# EAGLE design jammasave (EAGLE 7.6.0)
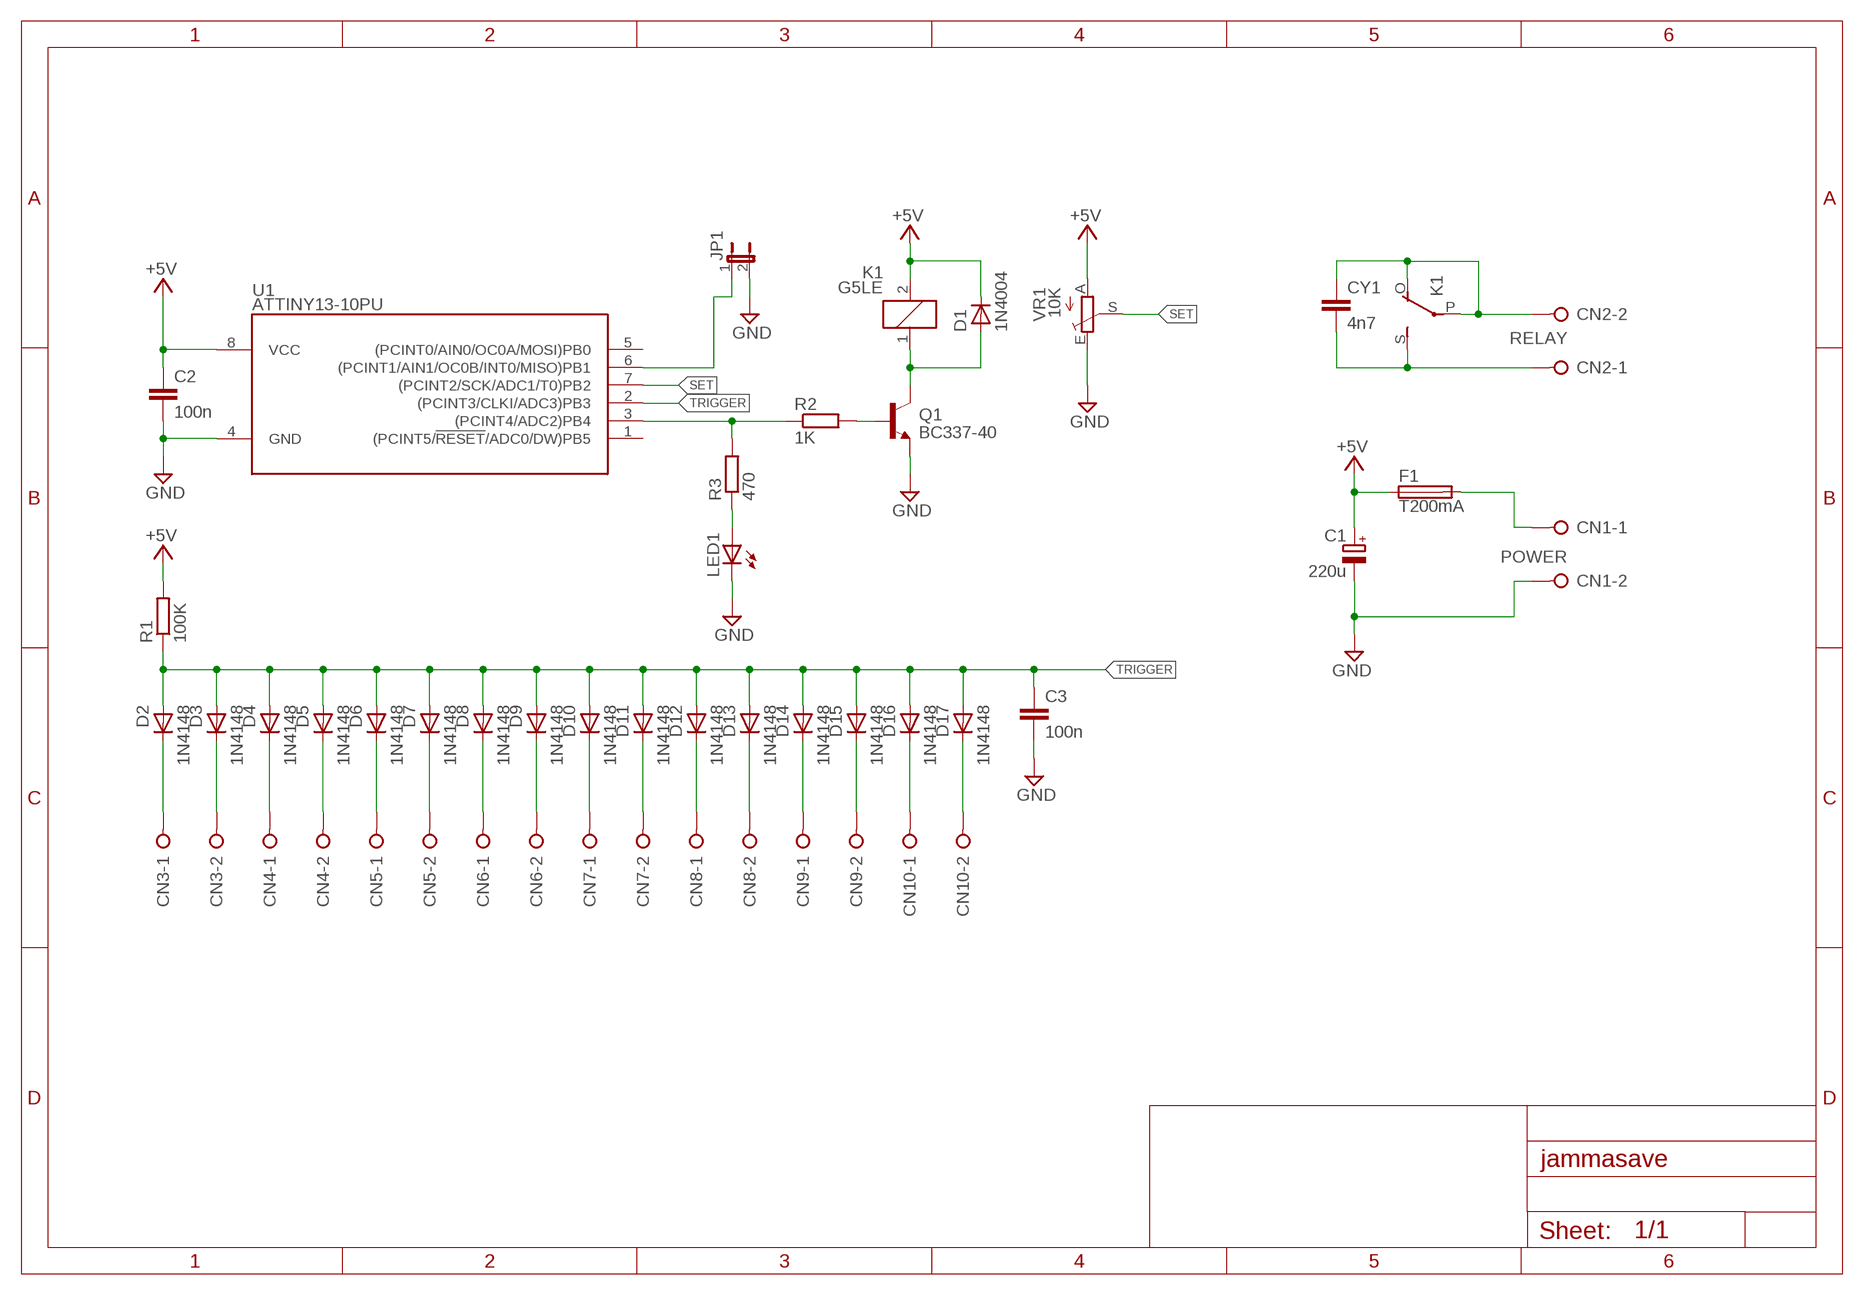
[diagram p0: schematic, sheet 1]

## Parts
C1  220u  CPOL-EUE3.5-8  [E3,5-8]
C2  100n  C-EU050-035X075  [C050-035X075]
C3  100n  C-EU050-035X075  [C050-035X075]
CN1  POWER  W237-02P  [W237-132]
CN2  RELAY  W237-2N  [W237-2N]
CN3  W237-02P  [W237-132]
CN4  W237-02P  [W237-132]
CN5  W237-02P  [W237-132]
CN6  W237-02P  [W237-132]
CN7  W237-02P  [W237-132]
CN8  W237-02P  [W237-132]
CN9  W237-02P  [W237-132]
CN10  W237-02P  [W237-132]
CY1  4n7  CYYC10B5  [YC10B5]
D1  1N4004  -DIODE_DO41-10  [DO41-10]
D2  1N4148  -DIODE_DO35-7  [DO35-7]
D3  1N4148  -DIODE_DO35-7  [DO35-7]
D4  1N4148  -DIODE_DO35-7  [DO35-7]
D5  1N4148  -DIODE_DO35-7  [DO35-7]
D6  1N4148  -DIODE_DO35-7  [DO35-7]
D7  1N4148  -DIODE_DO35-7  [DO35-7]
D8  1N4148  -DIODE_DO35-7  [DO35-7]
D9  1N4148  -DIODE_DO35-7  [DO35-7]
D10  1N4148  -DIODE_DO35-7  [DO35-7]
D11  1N4148  -DIODE_DO35-7  [DO35-7]
D12  1N4148  -DIODE_DO35-7  [DO35-7]
D13  1N4148  -DIODE_DO35-7  [DO35-7]
D14  1N4148  -DIODE_DO35-7  [DO35-7]
D15  1N4148  -DIODE_DO35-7  [DO35-7]
D16  1N4148  -DIODE_DO35-7  [DO35-7]
D17  1N4148  -DIODE_DO35-7  [DO35-7]
F1  T200mA  FUSETE5  [TE5]
JP1  JP1E  [JP1]
K1  G5LE  [G5LE]
LED1  LED3MM  [LED3MM]
Q1  BC337-40  -NPN_TO92_254-CBE  [TO92-254]
R1  100K  R-EU_0207/10  [0207/10]
R2  1K  R-EU_0207/10  [0207/10]
R3  470  R-EU_0207/10  [0207/10]
U1  ATTINY13-10PU  [DIL08]
VR1  10K  TRIM_EU-CA6V  [CA6V]

## Nets
+5V: C1.+ C2.1 D1.K(C) F1.1 K1.2 R1.2 U1.8(VCC) VR1.A
GND: C1.- C2.2 C3.2 CN1.2 JP1.2 LED1.K(C) Q1.3(E) U1.4(GND) VR1.E
N$1: Q1.2(B) R2.2
N$2: D1.A K1.1 Q1.1(C)
N$3: R2.1 R3.2 U1.3((PCINT4/ADC2)PB4)
N$4: CN1.1 F1.2
N$5: LED1.A R3.1
N$6: JP1.1 U1.6((PCINT1/AIN1/OC0B/INT0/MISO)PB1)
N$8: CN2.2 CY1.1 K1.O(2:O) K1.P(2:P)
N$11: CN2.1 CY1.2 K1.S(2:S)
N$13: CN3.1 D2.K(C)
N$14: CN3.2 D3.K(C)
N$15: CN4.1 D4.K(C)
N$16: CN4.2 D5.K(C)
N$17: CN5.1 D6.K(C)
N$18: CN5.2 D7.K(C)
N$19: CN6.1 D8.K(C)
N$20: CN6.2 D9.K(C)
N$21: CN7.1 D10.K(C)
N$22: CN7.2 D11.K(C)
N$23: CN8.1 D12.K(C)
N$24: CN8.2 D13.K(C)
N$25: CN9.1 D14.K(C)
N$26: CN9.2 D15.K(C)
N$27: CN10.1 D16.K(C)
N$28: CN10.2 D17.K(C)
SET: U1.7((PCINT2/SCK/ADC1/T0)PB2) VR1.S
TRIGGER: C3.1 D2.A D3.A D4.A D5.A D6.A D7.A D8.A D9.A D10.A D11.A D12.A D13.A D14.A D15.A D16.A D17.A R1.1 U1.2((PCINT3/CLKI/ADC3)PB3)
Unconnected: U1.1((PCINT5/!RESET!/ADC0/DW)PB5) U1.5((PCINT0/AIN0/OC0A/MOSI)PB0)

## Library data of the parts
C1 = rcl:CPOL-EU: POLARIZED CAPACITOR, European symbol
C2 C3 = rcl:C-EU: CAPACITOR, European symbol
CN1 CN3-CN10 = con-wago-508:W237-02P: WAGO SREW CLAMP; OC_FARNELL: unknown; OC_NEWARK: unknown
CN2 = con-wago-508:W237-2N: WAGO SREW CLAMP; OC_FARNELL: unknown; OC_NEWARK: unknown
CY1 = rcl:CY: Y CAPACITOR for power line
D1-D17 = jc-discretesemi:*-DIODE_?
F1 = fuse:FUSE: Fuse; OC_FARNELL: unknown; OC_NEWARK: unknown
JP1 = jumper:JP1E: JUMPER
K1 = relay:G5LE: RELAY 1 x switch, 10 A/120 V AC, 8 A/30 V DC, Omron; OC_FARNELL: unknown; OC_NEWARK: unknown
LED1 = led:LED: LED OSRAM: - CHIPLED LG R971, LG N971, LY N971, LG Q971, LY Q971, LO R971, LY R971 LH N974, LH R974 LS Q976, LO Q976, LY Q976 LO Q996 - Hyper CHIPLED LW Q18S LB Q993, LB Q99A, LB R99A - SideLED LS A670, LO A670, LY A670, LG A670, LP A670 LB A673, LV A673, LT A673, LW A673 LH A674 LY A675 LS A676, LA A676, LO A676, LY A676, LW A676 LS A679, LY A679, LG A679 - Hyper Micro SIDELED® LS Y876, LA Y876, LO Y876, LY Y876 LT Y87S - SmartLED LW L88C, LW L88S LB L89C, LB L89S, LG L890 LS L89K, LO L89K, LY L89K LS L896, LA L896, LO L896, LY L896 - TOPLED LS T670, LO T670, LY T670, LG T670, LP T670 LSG T670, LSP T670, LSY T670, LOP T670, LYG T670 LG T671, LOG T671, LSG T671 LB T673, LV T673, LT T673, LW T673 LH T674 LS T676, LA T676, LO T676, LY T676, LB T676, LH T676, LSB T676, LW T676 LB T67C, LV T67C, LT T67C, LS T67K, LO T67K, LY T67K, LW E67C LS E67B, LA E67B, LO E67B, LY E67B, LB E67C, LV E67C, LT E67C LW T67C LS T679, LY T679, LG T679 LS T770, LO T770, LY T770, LG T770, LP T770 LB T773, LV T773, LT T773, LW T773 LH T774 LS E675, LA E675, LY E675, LS T675 LS T776, LA T776, LO T776, LY T776, LB T776 LHGB T686 LT T68C, LB T68C - Hyper Mini TOPLED® LB M676 - Mini TOPLED Santana® LG M470 LS M47K, LO M47K, LY M47K Source: http://www.osram.convergy.de LUXEON: - LUMILED® LXK2-PW12-R00, LXK2-PW12-S00, LXK2-PW14-U00, LXK2-PW14-V00 LXK2-PM12-R00, LXK2-PM12-S00, LXK2-PM14-U00 LXK2-PE12-Q00, LXK2-PE12-R00, LXK2-PE12-S00, LXK2-PE14-T00, LXK2-PE14-U00 LXK2-PB12-K00, LXK2-PB12-L00, LXK2-PB12-M00, LXK2-PB14-N00, LXK2-PB14-P00, LXK2-PB14-Q00 LXK2-PR12-L00, LXK2-PR12-M00, LXK2-PR14-Q00, LXK2-PR14-R00 LXK2-PD12-Q00, LXK2-PD12-R00, LXK2-PD12-S00 LXK2-PH12-R00, LXK2-PH12-S00 LXK2-PL12-P00, LXK2-PL12-Q00, LXK2-PL12-R00 Source: www.luxeon.com KINGBRIGHT: KA-3528ASYC Source: www.kingbright.com
Q1 = jc-discretesemi:*-NPN_?
R1-R3 = rcl:R-EU_: RESISTOR, European symbol
U1 = jc-avr:ATTINY13-
VR1 = pot:TRIM_EU-: POTENTIOMETER

## Board
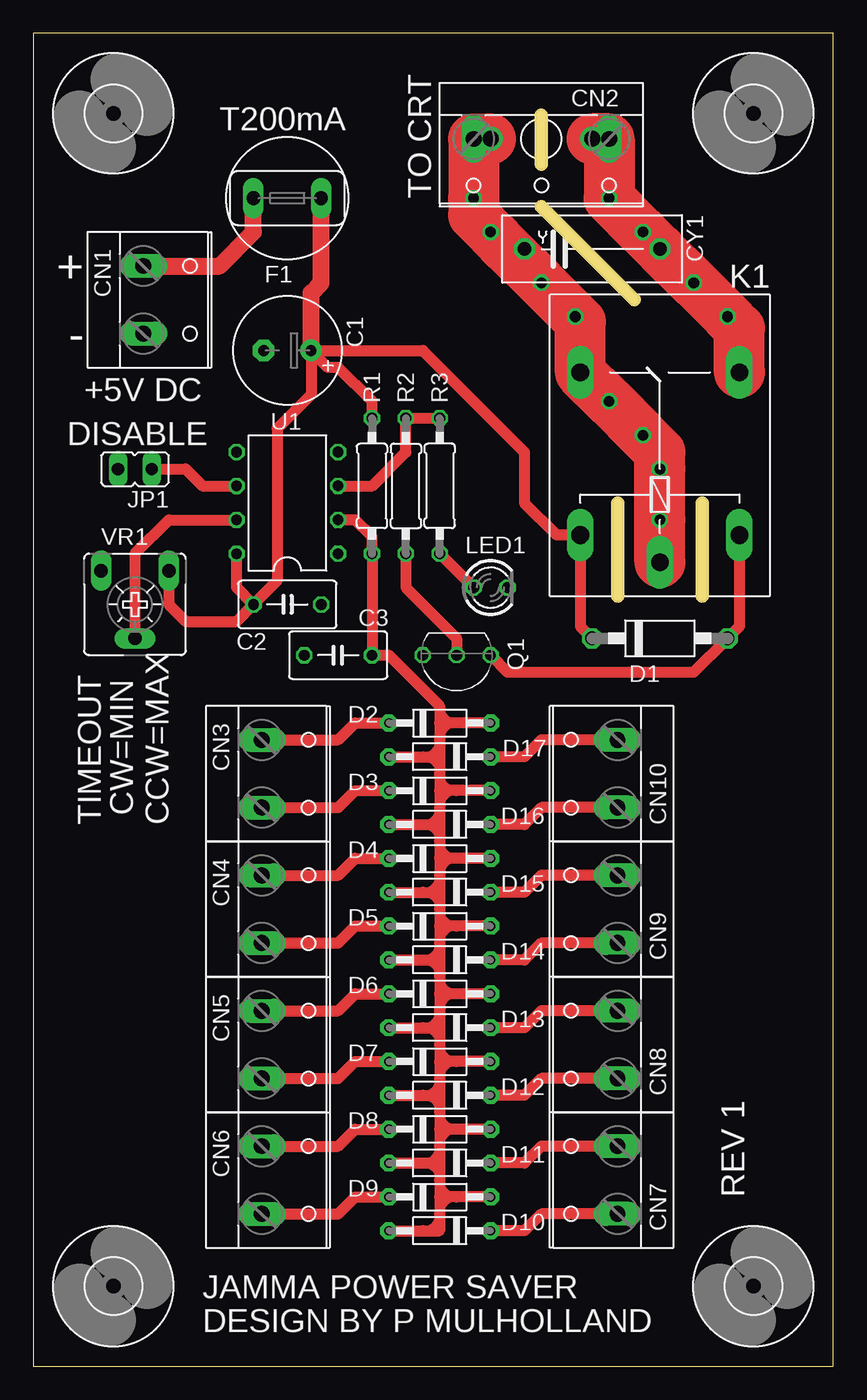
[diagram p1: board, top side]
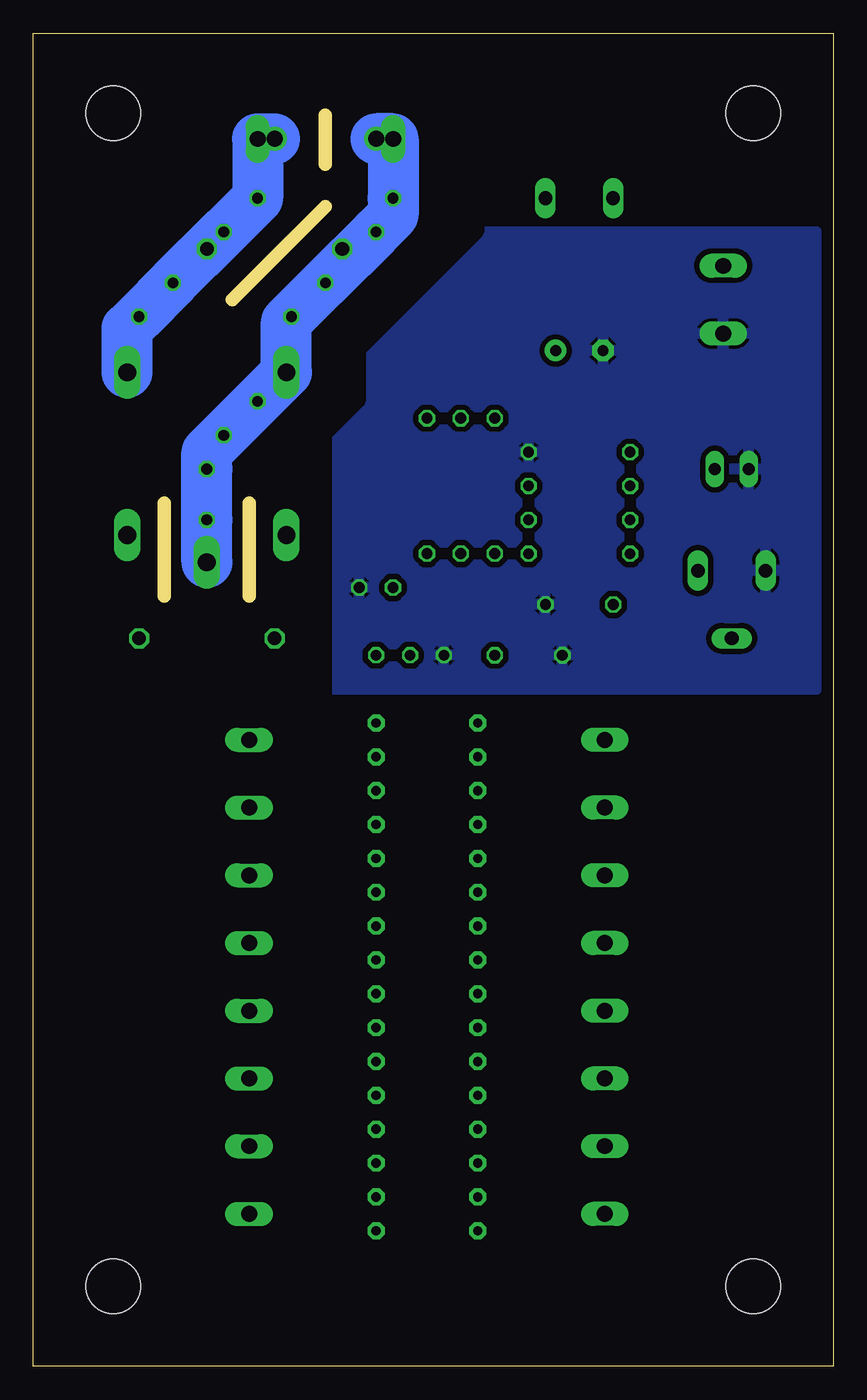
[diagram p2: board, bottom side, seen from below]

Size 60 x 100 mm. Coordinates in mm from the lower left corner, seen from the top.
Outline: 0,0 60,0 60,100 0,100 0,0
Copper layers (1*16): Top 0.035mm / dielectric 0.2mm / Bottom 0.035mm
Design rules "jlcpcb-2-layer": minimum track width 3.5mil, minimum drill 0.2mm, track to track 3.5mil, track to pad 5mil, pad to pad 5mil, via to via 5mil, smd to smd 0mil, copper to edge 0.1mm, drill to drill 5mil, minimum pad ring 4mil, minimum via ring 4mil, stop-mask expansion 3mil, vias tented up to drill 100mil, thermal gap 10mil
bRestrict: 5 lines
Milling: 4 lines

### Footprints (pad centres in the part's own frame; a part is rotated, then mirrored left to right if it is on the bottom)
E3,5-8 = drill 0.813 pad 1.6: + -1.778,0 | drill 0.813 pad 1.6 octagon: - 1.778,0
C050-035X075 = drill 0.813 octagon: 1 -2.54,0; 2 2.54,0
W237-132 = drill 1.194 long: 1 -2.54,-0.635; 2 2.54,-0.635
W237-2N = drill 1.194 long: 1 -5.08,-0.635; 2 5.08,-0.635
YC10B5 = drill 1.016 octagon: 1 -5.08,0; 2 5.08,0
DO41-10 = drill 1 octagon: A 5.08,0; K -5.08,0
DO35-7 = drill 0.7 pad 1.27 octagon: A 3.81,0; K -3.81,0
TE5 = drill 1.016 long: 1 -2.54,0; 2 2.54,0
JP1 = drill 0.914 long: 1 0,-1.27; 2 0,1.27
G5LE = drill 1.321 long: 1 -7.493,-5.969; 2 -7.493,5.969; O 4.699,5.969; P -9.525,0; S 4.699,-5.969
LED3MM = drill 0.813 octagon: A -1.27,0; K 1.27,0
TO92-254 = drill 0.8 octagon: 1 -2.54,0; 2 0,0; 3 2.54,0
0207/10 = drill 0.813 octagon: 1 -5.08,0; 2 5.08,0
DIL08 = drill 0.8 octagon: 1 -3.81,-3.81; 2 -1.27,-3.81; 3 1.27,-3.81; 4 3.81,-3.81; 5 3.81,3.81; 6 1.27,3.81; 7 -1.27,3.81; 8 -3.81,3.81
4,1 = hole 4.1: 0,0
CA6V = drill 1.016 long: A -2.54,-2.54; E 2.54,-2.54; S 0,2.54

### Placement (x,y rotation side)
C1  19.05,76.2 180 top
C2  19.05,57.15 0 top
C3  22.86,53.34 180 top
CN1  8.89,80.01 270 top
CN2  38.1,91.44 180 top
CN3  17.78,44.45 270 top
CN4  17.78,34.29 270 top
CN5  17.78,24.13 270 top
CN6  17.78,13.97 270 top
CN7  43.18,13.97 90 top
CN8  43.18,24.13 90 top
CN9  43.18,34.29 90 top
CN10  43.18,44.45 90 top
CY1  41.91,83.82 0 top
D1  46.99,54.61 0 top
D2  30.48,48.26 0 top
D3  30.48,43.18 0 top
D4  30.48,38.1 0 top
D5  30.48,33.02 0 top
D6  30.48,27.94 0 top
D7  30.48,22.86 0 top
D8  30.48,17.78 0 top
D9  30.48,12.7 0 top
D10  30.48,10.16 180 top
D11  30.48,15.24 180 top
D12  30.48,20.32 180 top
D13  30.48,25.4 180 top
D14  30.48,30.48 180 top
D15  30.48,35.56 180 top
D16  30.48,40.64 180 top
D17  30.48,45.72 180 top
F1  19.05,87.63 180 top
JP1  7.62,67.31 90 top
K1  46.99,69.85 90 top
LED1  34.29,58.42 0 top
Q1  31.75,53.34 180 top
R1  25.4,66.04 90 top
R2  27.94,66.04 270 top
R3  30.48,66.04 90 top
U1  19.05,64.77 90 top
U$1  [4,1]  6,6 0 top
U$2  [4,1]  54,6 0 top
U$3  [4,1]  54,94 0 top
U$4  [4,1]  6,94 0 top
VR1  7.62,57.15 180 top

### Tracks (layer width: path | path; a pad name or v marks a point on that pad's centre or on a via)
+5V
  Top 0.813: C2.1 15.24,58.42 U1.8 | C1.+ 20.83,72.9 18.29,70.36 18.29,58.93 C2.1 | C1.+ 29.21,76.2 36.83,68.58 36.83,64.77 39.24,62.36 K1.2 41.02,55.5 D1.K | R1.2 25.4,72.39 22.86,74.93 22.1,74.93 C1.+ | VR1.A 10.16,57.15 11.43,55.88 15.24,55.88 C2.1
  Top 1.27: C1.+ 20.83,80.52 21.59,81.28 F1.1
GND
  pour Bottom (isolate 0.406): 1.27,85.09 38.1,85.09 38.1,50.8 1.27,50.8
N$1
  Top 0.813: R2.2 27.94,58.42 31.75,54.61 Q1.2
N$2
  Top 0.813: Q1.1 35.56,52.07 49.53,52.07 D1.A 52.96,55.5 K1.1
N$3
  Top 0.813: U1.3 25.4,66.04 27.94,68.58 R2.1 R3.2
N$4
  Top 1.27: CN1.1 13.97,82.55 16.51,85.09 F1.2
N$5
  Top 0.813: R3.1 LED1.A
N$6
  Top 0.813: JP1.1 11.43,67.31 12.7,66.04 U1.6
N$8  (via drill 0.8, 1.2)
  Top 0.813: CY1.1 35.56,83.82
  Top 3.81: K1.P v46.99,63.5 v46.99,67.31 46.99,68.58 v45.72,69.85 v43.18,72.39 K1.O 41.02,78.36 v40.64,78.74 v38.1,81.28 35.56,83.82 v34.29,85.09 33.02,86.36 v33.02,87.63 CN2.2 v34.29,92.08
  Bottom 3.81: K1.P v46.99,63.5 v46.99,67.31 46.99,68.58 v45.72,69.85 v43.18,72.39 K1.O 41.02,78.36 v40.64,78.74 v38.1,81.28 v34.29,85.09 33.02,86.36 v33.02,87.63 CN2.2 v34.29,92.08
N$11  (via drill 0.8, 1.2)
  Top 3.81: v41.91,92.08 CN2.1 v43.18,87.63 v45.72,85.09 CY1.2 v49.53,81.28 v52.07,78.74 52.96,77.85 K1.S
  Bottom 3.81: v41.91,92.08 CN2.1 v43.18,87.63 v45.72,85.09 v49.53,81.28 v52.07,78.74 52.96,77.85 K1.S
N$13
  Top 0.813: CN3.1 22.86,46.99 24.13,48.26 D2.K
N$14
  Top 0.813: CN3.2 22.86,41.91 24.13,43.18 D3.K
N$15
  Top 0.813: CN4.1 22.86,36.83 24.13,38.1 D4.K
N$16
  Top 0.813: CN4.2 22.86,31.75 24.13,33.02 D5.K
N$17
  Top 0.813: CN5.1 22.86,26.67 24.13,27.94 D6.K
N$18
  Top 0.813: CN5.2 22.86,21.59 24.13,22.86 D7.K
N$19
  Top 0.813: CN6.1 22.86,16.51 24.13,17.78 D8.K
N$20
  Top 0.813: CN6.2 22.86,11.43 24.13,12.7 D9.K
N$21
  Top 0.813: CN7.1 38.1,11.43 36.83,10.16 D10.K
N$22
  Top 0.813: CN7.2 38.1,16.51 36.83,15.24 D11.K
N$23
  Top 0.813: CN8.1 38.1,21.59 36.83,20.32 D12.K
N$24
  Top 0.813: CN8.2 38.1,26.67 36.83,25.4 D13.K
N$25
  Top 0.813: CN9.1 38.1,31.75 36.83,30.48 D14.K
N$26
  Top 0.813: CN9.2 38.1,36.83 36.83,35.56 D15.K
N$27
  Top 0.813: CN10.1 38.1,41.91 36.83,40.64 D16.K
N$28
  Top 0.813: CN10.2 38.1,46.99 36.83,45.72 D17.K
SET
  Top 0.813: U1.7 10.16,63.5 7.62,60.96 VR1.S
TRIGGER
  Top 0.61: 29.21,10.16 arc90 30.48,11.43 arc-90 31.75,12.7 arc-90 30.48,13.97 arc90 29.21,15.24 arc90 30.48,16.51 arc-90 31.75,17.78 arc-90 30.48,19.05 arc90 29.21,20.32 arc90 30.48,21.59 arc-90 31.75,22.86 arc-90 30.48,24.13 arc90 29.21,25.4 arc90 30.48,26.67 arc-90 31.75,27.94 arc-90 30.48,29.21 arc90 29.21,30.48 arc90 30.48,31.75 arc-90 31.75,33.02 arc-90 30.48,34.29 arc90 29.21,35.56 arc90 30.48,36.83 arc-90 31.75,38.1 arc-90 30.48,39.37 arc90 29.21,40.64 arc90 30.48,41.91 arc-90 31.75,43.18 arc-90 30.48,44.45 arc90 29.21,45.72 arc90 30.48,46.99 arc-90 31.75,48.26 arc-90 30.48,49.53
  Top 0.813: 30.48,48.26 30.48,46.99 30.48,45.72 | 30.48,45.72 30.48,44.45 30.48,43.18 | 30.48,43.18 30.48,41.91 30.48,40.64 | 30.48,40.64 30.48,39.37 30.48,38.1 | 30.48,38.1 30.48,36.83 30.48,35.56 | 30.48,35.56 30.48,34.29 30.48,33.02 | 30.48,33.02 30.48,31.75 30.48,30.48 | 30.48,30.48 30.48,29.21 30.48,27.94 | 30.48,27.94 30.48,26.67 30.48,25.4 | 30.48,25.4 30.48,24.13 30.48,22.86 | 30.48,22.86 30.48,21.59 30.48,20.32 | 30.48,20.32 30.48,19.05 30.48,17.78 | 30.48,17.78 30.48,16.51 30.48,15.24 | 30.48,15.24 30.48,13.97 30.48,12.7 | 30.48,12.7 30.48,11.43 30.48,10.16 29.21,10.16 D10.A | D11.A 29.21,15.24 30.48,15.24 | D12.A 29.21,20.32 30.48,20.32 | D9.A 31.75,12.7 30.48,12.7 | D8.A 31.75,17.78 30.48,17.78 | D7.A 31.75,22.86 30.48,22.86 | D13.A 29.21,25.4 30.48,25.4 | D6.A 31.75,27.94 30.48,27.94 | D2.A 31.75,48.26 30.48,48.26 | D17.A 29.21,45.72 30.48,45.72 | D3.A 31.75,43.18 30.48,43.18 | D16.A 29.21,40.64 30.48,40.64 | D4.A 31.75,38.1 30.48,38.1 | D15.A 29.21,35.56 30.48,35.56 | D5.A 31.75,33.02 30.48,33.02 | D14.A 29.21,30.48 30.48,30.48 | 30.48,48.26 30.48,49.53 26.67,53.34 C3.1 R1.1 25.4,62.23 24.13,63.5 U1.2

### Text on the board
tPlace: T200mA | TO CRT | + | - | +5V DC | DISABLE | TIMEOUT | CW=MIN / CCW=MAX | REV 1 | JAMMA POWER SAVER | DESIGN BY P MULHOLLAND